# Altium project StrainLogger.PrjPCB
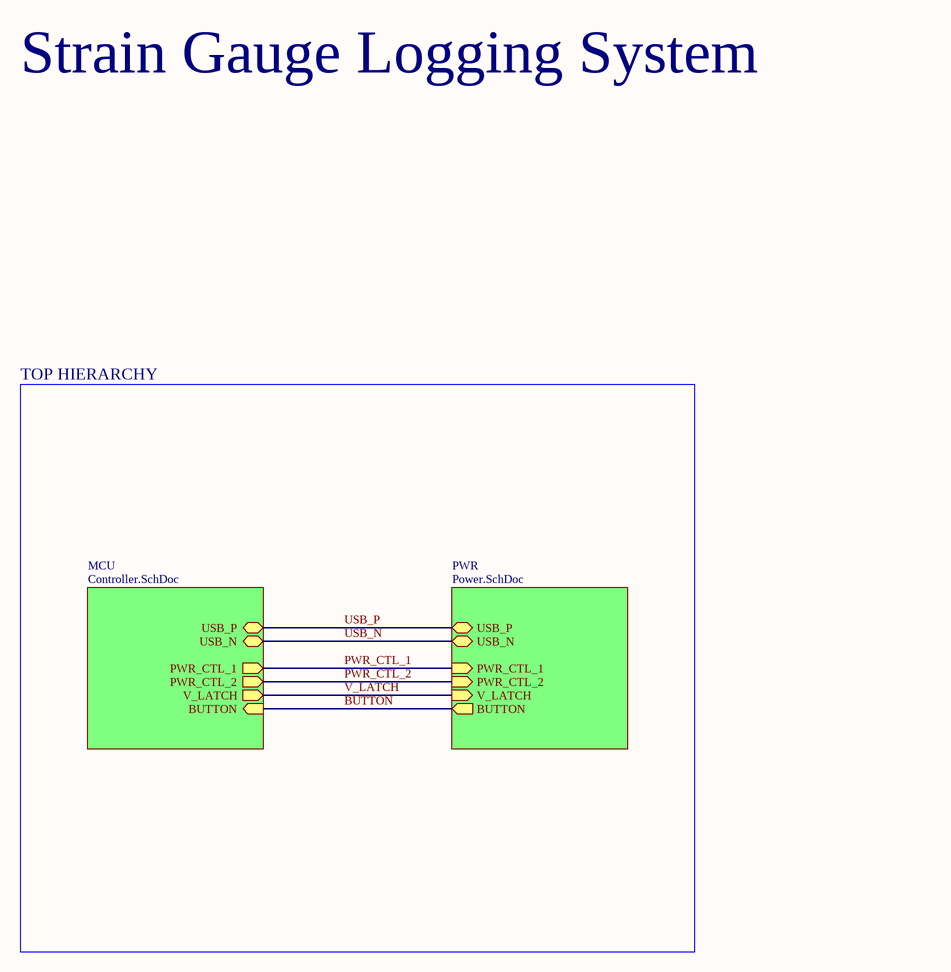
[diagram p0: TopSheet.SchDoc]
SheetTotal: 4; ProjectRevision: 1.0; ProjectAuthor: Jamie Stepanian; Project: Strain Logger
4 sheets, 171 parts. Net scope: hierarchical (ports join the sheet entries above them; power ports are global).
Board file: StrainLogger.PcbDoc
Sheets:
  TopSheet.SchDoc
    MCU = Controller.SchDoc
      ST1 = Strain-TI.SchDoc
      ST2 = Strain-TI.SchDoc
      ST3 = Strain-TI.SchDoc
      ST4 = Strain-TI.SchDoc
    PWR = Power.SchDoc

## Sheet TopSheet.SchDoc
size 431 x 279 mm; SheetNumber: 1; SheetTotal: 4; SheetTitle: Top

### Sub-sheets
MCU = Controller.SchDoc: USB_N (bidir), USB_P (bidir), PWR_CTL_2 (out), PWR_CTL_1 (out), V_LATCH (out), BUTTON (in)
PWR = Power.SchDoc: USB_P (bidir), BUTTON (out), USB_N (bidir), PWR_CTL_1 (in), PWR_CTL_2 (in), V_LATCH (in)

### Nets
BUTTON: sheet MCU/BUTTON, sheet PWR/BUTTON
PWR_CTL_1: sheet MCU/PWR_CTL_1, sheet PWR/PWR_CTL_1
PWR_CTL_2: sheet MCU/PWR_CTL_2, sheet PWR/PWR_CTL_2
USB_N: sheet MCU/USB_N, sheet PWR/USB_N
USB_P: sheet MCU/USB_P, sheet PWR/USB_P
V_LATCH: sheet MCU/V_LATCH, sheet PWR/V_LATCH

### Notes on the sheet
- Strain Gauge Logging System
- TOP HIERARCHY
- Variant name
- Number:
- Date:
- Revision:
- Sheet
- of
- Drawn by
- Verified by:

## Sheet Controller.SchDoc
size 431 x 279 mm; SheetNumber: 2; SheetTotal: 4; SheetTitle: Controller
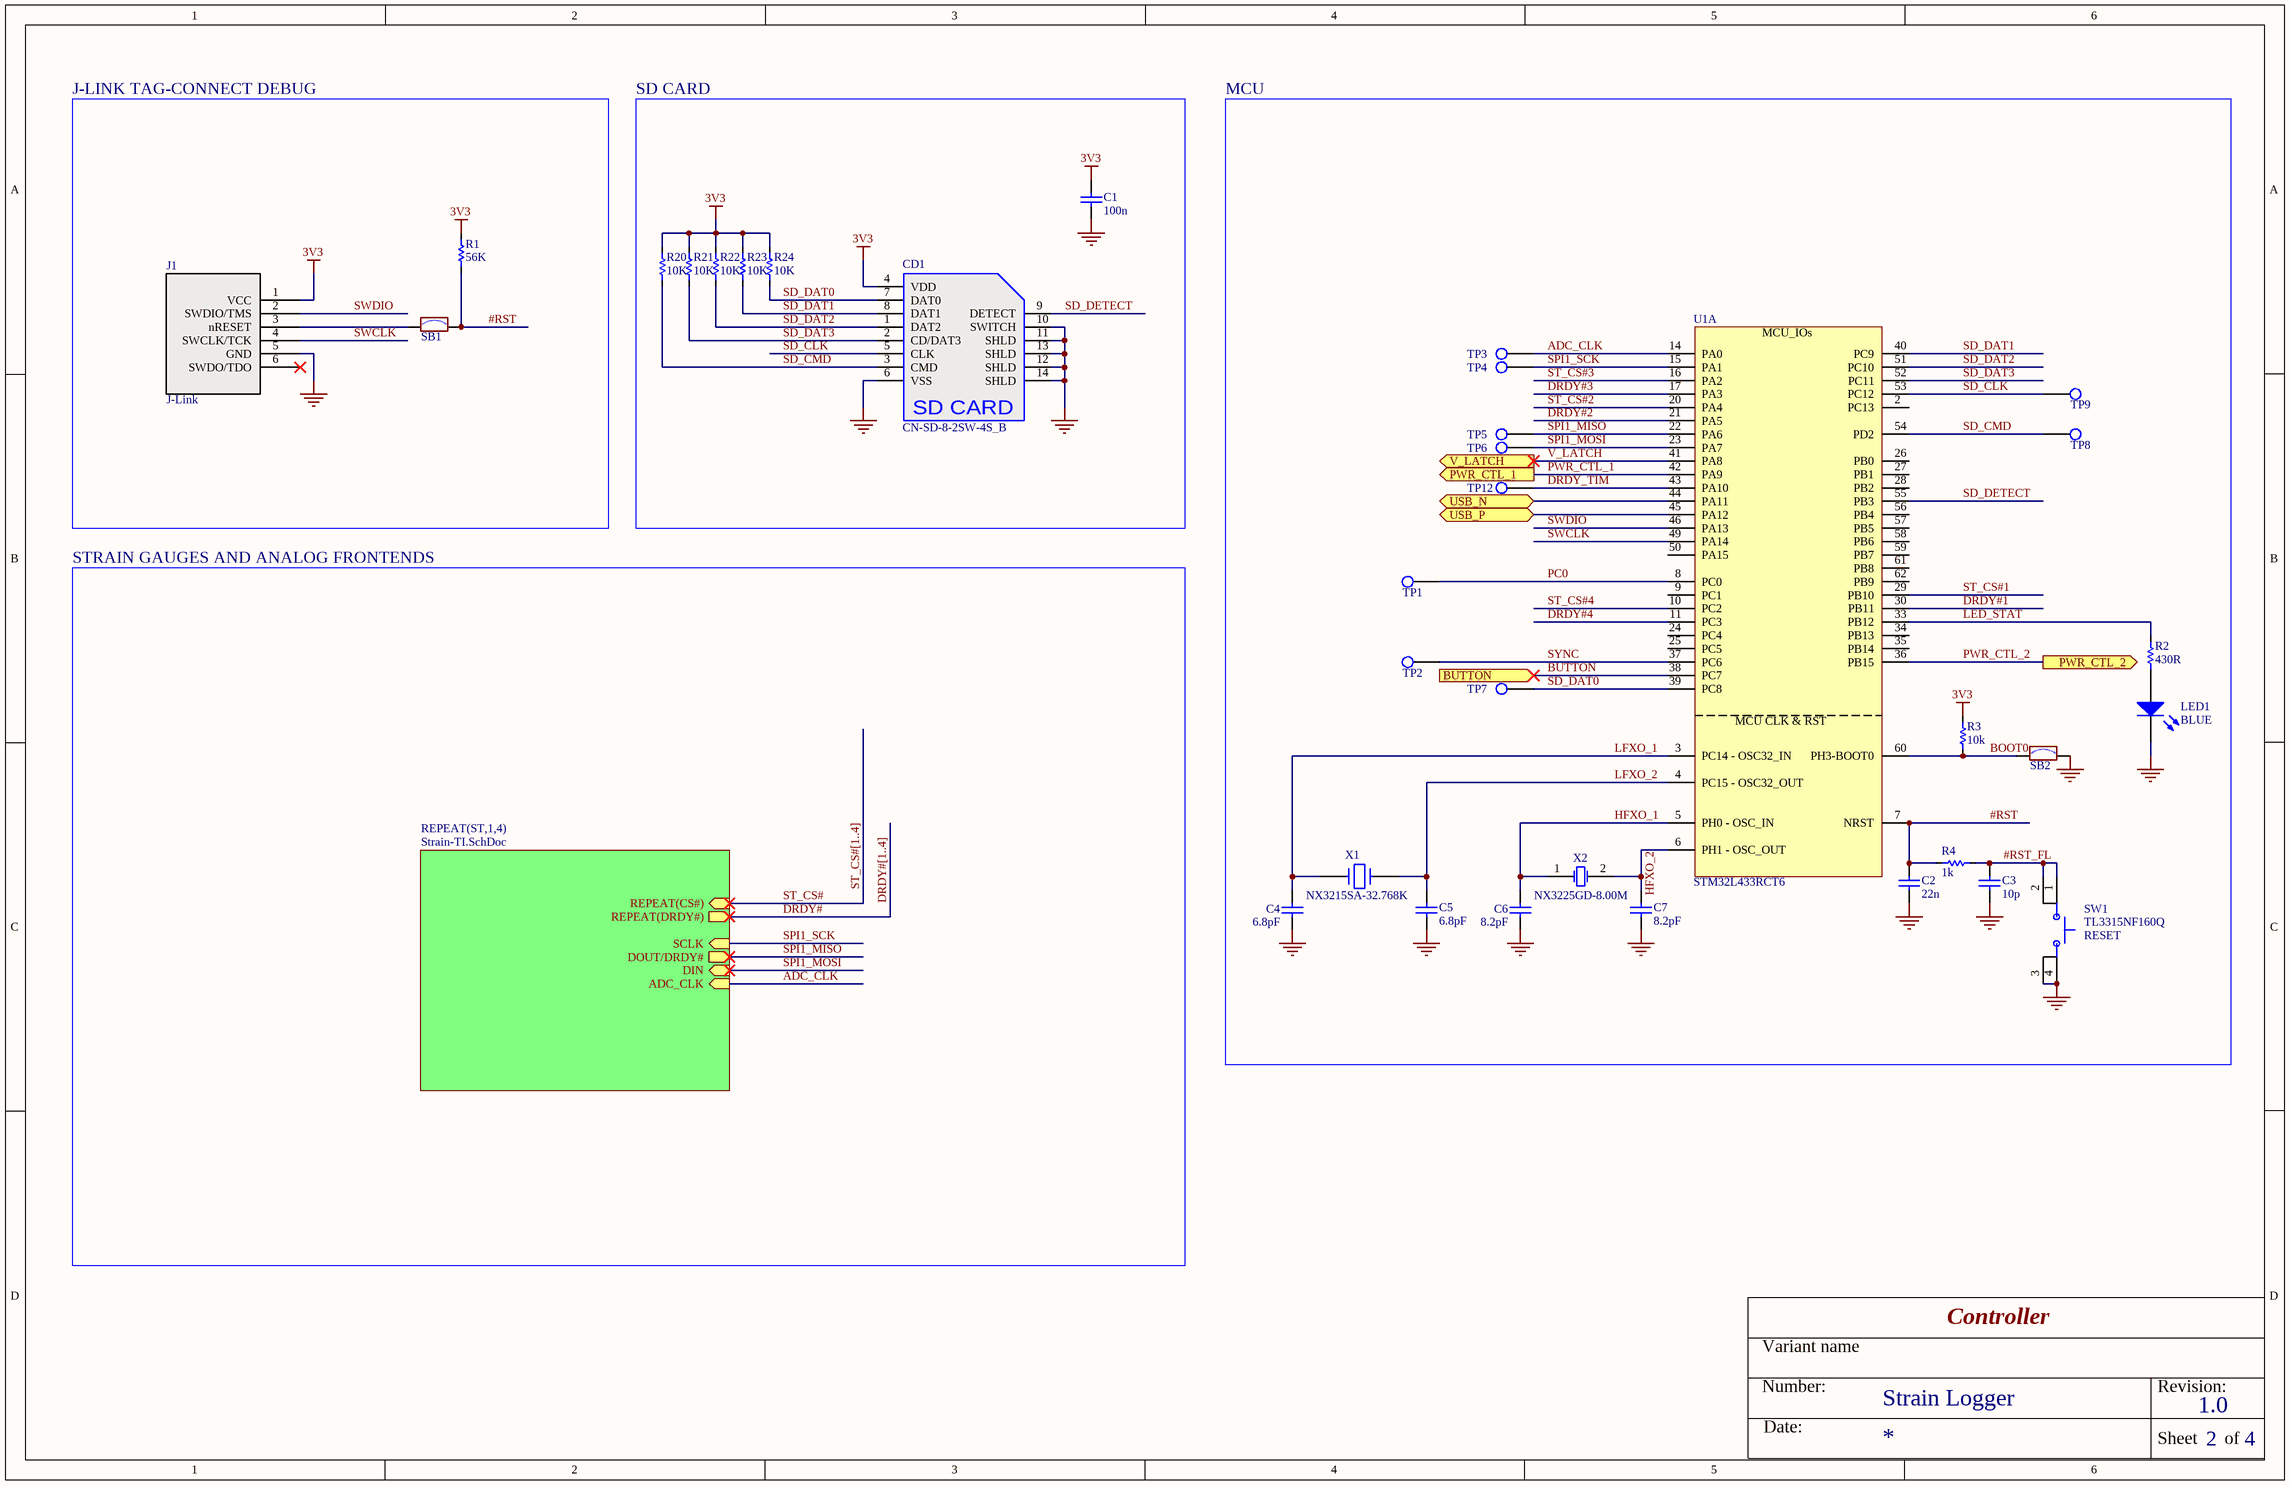
[diagram p1: Controller.SchDoc]

### Parts
C1  100n  [CAP_0603_M]
C2  22n  [CAP_0603_M]
C3  10p  [CAP_0603_M]
C4  value 6.8pF  [CAP_0402_M]  (hidden comment: Capacitor)
C5  value 6.8pF  [CAP_0402_M]  (hidden comment: Capacitor)
C6  value 8.2pF  [CAP_0402_M]  (hidden comment: Capacitor)
C7  value 8.2pF  [CAP_0402_M]  (hidden comment: Capacitor)
CD1  CN-SD-8-2SW-4S_B  [MOLX-502774-0891_V]
J1  J-Link  [TC2030-MCP-NL_R2]  (no BOM)
LED1  BLUE  [0603_A]
R1  56K  [RES_0603_M]
R2  430R  [RES_0603_M]
R3  10k  [RES_0603_M]
R4  1k  [RES_0603_M]
R20  10K  [RES_0402]
R21  10K  [RES_0402]
R22  10K  [RES_0402]
R23  10K  [RES_0402]
R24  10K  [RES_0402]
SB1  SB_ON  [SOLDER-BRIDGE_R0603-0R]  (value not drawn)  (no BOM)
SB2  SB_ON  [SOLDER-BRIDGE_R0603-0R]  (value not drawn)  (no BOM)
SW1  TL3315NF160Q  [E-Switch_TL3315NF160Q]
TP1  TP-1.5mm  [TP-1.5mm]  (value not drawn)
TP2  TP-1.5mm  [TP-1.5mm]  (value not drawn)
TP3  TP-1.5mm  [TP-1.5mm]  (value not drawn)
TP4  TP-1.5mm  [TP-1.5mm]  (value not drawn)
TP5  TP-1.5mm  [TP-1.5mm]  (value not drawn)
TP6  TP-1.5mm  [TP-1.5mm]  (value not drawn)
TP7  TP-1.5mm  [TP-1.5mm]  (value not drawn)
TP8  TP-1.5mm  [TP-1.5mm]  (value not drawn)
TP9  TP-1.5mm  [TP-1.5mm]  (value not drawn)
TP12  TP-1.5mm  [TP-1.5mm]  (value not drawn)
U1  STM32L433RCT6  [ICC_LQFP64_10X10_P050]  (part A of 2)
X1  value NX3215SA-32.768K  [CRY_NX3215SA_2P]  (hidden comment: XTAL_32K_NX3215SA)
X2  value NX3225GD-8.00M  [CRY_NX3225GD_2P]  (hidden comment: XTAL_8M_NX3225GD)

### Blocks framed on the sheet
J-LINK TAG-CONNECT DEBUG: J1 R1 SB1
SD CARD: C1 CD1 R20-R24
MCU: C2-C7 LED1 R2-R4 SB2 SW1 TP1-TP9 TP12 U1 X1 X2

### Sub-sheets
REPEAT(ST,1,4) = Strain-TI.SchDoc: REPEAT(CS#) (in), SCLK (in), DIN (in), DOUT/DRDY# (out), REPEAT(DRDY#) (out), ADC_CLK (in)

### Ports
BUTTON (in), PWR_CTL_1 (out), PWR_CTL_2 (out), USB_N (bidir), USB_P (bidir), V_LATCH (out)

### Nets
3V3: C1.2 CD1.4(VDD) J1.1(VCC) R1.2 R3.2 R20.2 R21.2 R22.2 R23.2 R24.2  [project net BR_VDD]
GND: C1.1 C2.1 C3.1 C4.2 C5.2 C6.1 C7.1 CD1.6(VSS) CD1.10(SWITCH) CD1.11(SHLD) CD1.12(SHLD) CD1.13(SHLD) CD1.14(SHLD) J1.5(GND) LED1.1(K) SB2.2 SW1.3 SW1.4
#RST: C2.2 R1.1 R4.2 SB1.2 U1.7(NRST)  [project net #RST_2]
#RST_FL: C3.2 R4.1 SW1.1 SW1.2  [project net #RST_FL_2]
ADC_CLK: TP3.1 U1.14(PA0) ; sheet REPEAT(ST,1,4)/ADC_CLK
BOOT0: R3.1 SB2.1 U1.60(PH3-BOOT0)  [project net BOOT0_2]
BUTTON: U1.38(PC7) ; port BUTTON
DRDY#: sheet REPEAT(ST,1,4)/REPEAT(DRDY#)
DRDY#1: U1.30(PB11)
DRDY#2: U1.21(PA5)
DRDY#3: U1.17(PA3)
DRDY#4: U1.11(PC3)
DRDY_TIM: TP12.1 U1.43(PA10)  [project net DRDY_TIM_2]
HFXO_1: C6.2 U1.5(PH0_-_OSC_IN) X2.1(OSC1)  [project net HFXO_1_2]
HFXO_2: C7.2 U1.6(PH1_-_OSC_OUT) X2.2(OSC2)  [project net HFXO_2_2]
LED_STAT: R2.2 U1.33(PB12)  [project net LED_STAT_2]
LFXO_1: C4.1 U1.3(PC14_-_OSC32_IN) X1.1  [project net LFXO_1_2]
LFXO_2: C5.1 U1.4(PC15_-_OSC32_OUT) X1.2  [project net LFXO_2_2]
PC0: TP1.1 U1.8(PC0)  [project net PC0_2]
PWR_CTL_1: U1.42(PA9) ; port PWR_CTL_1
PWR_CTL_2: U1.36(PB15) ; port PWR_CTL_2
SD_CLK: CD1.5(CLK) TP9.1 U1.53(PC12)  [project net SD_CLK_2]
SD_CMD: CD1.3(CMD) R20.1 TP8.1 U1.54(PD2)  [project net SD_CMD_2]
SD_DAT0: CD1.7(DAT0) R24.1 TP7.1 U1.39(PC8)  [project net SD_DAT0_2]
SD_DAT1: CD1.8(DAT1) R23.1 U1.40(PC9)  [project net SD_DAT1_2]
SD_DAT2: CD1.1(DAT2) R22.1 U1.51(PC10)  [project net SD_DAT2_2]
SD_DAT3: CD1.2(CD/DAT3) R21.1 U1.52(PC11)  [project net SD_DAT3_2]
SD_DETECT: CD1.9(DETECT) U1.55(PB3)  [project net SD_DETECT_2]
SPI1_MISO: TP5.1 U1.22(PA6) ; sheet REPEAT(ST,1,4)/DOUT/DRDY#
SPI1_MOSI: TP6.1 U1.23(PA7) ; sheet REPEAT(ST,1,4)/DIN
SPI1_SCK: TP4.1 U1.15(PA1) ; sheet REPEAT(ST,1,4)/SCLK
ST_CS#: sheet REPEAT(ST,1,4)/REPEAT(CS#)
ST_CS#1: U1.29(PB10)
ST_CS#2: U1.20(PA4)
ST_CS#3: U1.16(PA2)
ST_CS#4: U1.10(PC2)
SWCLK: J1.4(SWCLK/TCK) U1.49(PA14)  [project net SWCLK_2]
SWDIO: J1.2(SWDIO/TMS) U1.46(PA13)  [project net SWDIO_2]
SYNC: TP2.1 U1.37(PC6)  [project net SYNC_2]
USB_N: U1.44(PA11) ; port USB_N
USB_P: U1.45(PA12) ; port USB_P
V_LATCH: U1.41(PA8) ; port V_LATCH
NetJ1_3: J1.3(nRESET) SB1.1
NetLED1_2: LED1.2(A) R2.1

Not connected (* = marked no-connect by the designer): J1 6(SWDO/TDO)*; U1 2(PC13) 9(PC1) 24(PC4) 25(PC5) 26(PB0) 27(PB1) 28(PB2) 34(PB13) 35(PB14) 50(PA15) 56(PB4) 57(PB5) 58(PB6) 59(PB7) 61(PB8) 62(PB9)

### Buses and harness runs
bus DRDY#[1..4]
bus ST_CS#[1..4]

### Notes on the sheet
- STRAIN GAUGES AND ANALOG FRONTENDS
- (near SW1) RESET
- Variant name
- Number:
- Date:
- Revision:
- Sheet
- of
- (in symbol MOLEX_CN-SD-8-2SW-4S_B) SD CARD
- (in symbol STM32L433RCT6, part A) MCU_IOs; MCU CLK & RST

### Library data of the parts
C1 = CAP_0603: CAP 100nF 6.3V 20% X7R 0603; Category: capacitor; Created: 2018-07-01; Created By: JS; Last Modified: 2018-07-01
C2 = CAP_0603: CAP 22nF 6.3V 20% X7R 0603; Category: capacitor; Created: 2018-07-01; Created By: JS; Last Modified: 2018-07-01
C3 = CAP_0603: CAP 10pF 6.3V 20% NP0 0603; Category: capacitor; Created: 2018-07-01; Created By: JS; Last Modified: 2018-07-01
C4 C5 = MCD-00674: CAP 6.8pF 25V 4% NP0 0402; Manufacturer_Part_Number: CC0402CRNPO9BN6R8; Manufacturer: YAGEO; Provided_By: Subcon; Initial_Board_Reference: mb1319; Internal_Part_Number: MCD-00674; Status: Released; Part_Type: Capacitor; Package: C0402; ComponentLink1Description: Yageo_Capacitor_NP0_16V-to-50V.pdf; ComponentLink1URL: http://tunmcdsvn.tun.st.com/Component_Datasheet_Library/Trunk/Capacitors/Yageo_Capacitor_NP0_16V-to-50V.pdf; ECCN_US: n/a; ECCN_EU: n/a
C6 C7 = MCD-00004: CAP 8.2pF 25V 4% NP0 0402; Manufacturer_Part_Number: 04025A8R2CAT2A; Manufacturer: AVX; Provided_By: Subcon; Initial_Board_Reference: mb1274; Internal_Part_Number: MCD-00004; ComponentLink1Description: AVX_Capacitor_C0G-NP0-series.pdf; ECCN_US: n/a; ECCN_EU: n/a; Status: Released; Part_Type: Capacitor; Package: 0402
CD1 = MOLEX_CN-SD-8-2SW-4S_B: Micro SD Card Slot; Manufacturer PN: 502774-0891_V; Manufacturer: Molex
J1 = TC2030-CTX-NL
LED1 = CMP-1426-00005-1: SMD LED Blue 0603; PartNumber: 150060YS75000; Manufacturer: Wuerth Elektronik; Color: Yellow; ComponentLink1URL: http://www.we-online.com; ComponentLink2Description: Datasheet; ComponentLink2URL: http://katalog.we-online.com/led/datasheet/150060YS75000.pdf; ComponentLink1Description: Manufacturer URL; PackageReference: 0603_A
R1 = RES_0603: RES 56K 1/5W 0603; Manufacturer: *; Manufacturer PN: *; Category: resistor; Created: 2018-07-01; Last Modified: 2018-07-01; Created By: JS
R2 = RES_0603: RES 430R 1/5W 0603; Manufacturer: *; Manufacturer PN: *; Category: resistor; Created: 2018-07-01; Last Modified: 2018-07-01; Created By: JS
R3 = RES_0603: RES 10K 1/5W 0603; Manufacturer: *; Manufacturer PN: *; Category: resistor; Created: 2018-07-01; Last Modified: 2018-07-01; Created By: JS
R4 = RES_0603: RES 1K 1/5W 0603; Manufacturer: *; Manufacturer PN: *; Category: resistor; Created: 2018-07-01; Last Modified: 2018-07-01; Created By: JS
R20-R24 = RES_0402: RES 10K 1/5W 0402; Manufacturer: *; Manufacturer PN: *; Category: resistor; Created: 2018-09-12; Last Modified: 2018-09-12; Created By: JS
SB1 SB2 = SB_ON: Solder Bridge ON; Internal_Part_Number: MCD-00071; Part_Type: Mechanical; Provided_By: Subcon; Initial_Board_Reference: mb1274; ECCN_US: n/a; ECCN_EU: n/a; Status: Released
SW1 = E-SWITCH_TL3315NF160Q: SWITCH TACTILE SPST-NO 0.05A 15V
TP1 = TP-1.5mm: Test Point; PCB_Label: PC0
TP2 = TP-1.5mm: Test Point; PCB_Label: SYNC
TP3-TP9 TP12 = TP-1.5mm: Test Point; PCB_Label: ADC_CLK
U1 = STM32L433RCT6: Microcontroller 256_STM32L433 . LQFP64 package; Internal_Part_Number: MCD-00548; Part_Type: IC; Manufacturer: STMICROELECTRONICS; ECCN_US: 3A991A2; ECCN_EU: NEC; Provided_By: STM; Initial_Board_Reference: mb1319; Status: Symbol available; Manufacturer_Part_Number: STM32L433RCT6; Value: STM32L433RCT6
X1 = XTAL_32K_NX3215SA: Crystal 32.768kHz, 6pF, -+20PPM, R=50K, SMD; Internal_Part_Number: MCD-00091; Manufacturer_Part_Number: NX3215SA 32.768KHz EXS00A-MU00525; Manufacturer: NDK; Part_Type: Crystal_Osc; ECCN_US: EAR99; ECCN_EU: NEC; Provided_By: STM; Initial_Board_Reference: mb1274; ComponentLink1Description: NDK_Crystal-For-ST_NX3215SA 32.768KHz EXS00A-MU00525 (EXS10B-21238).pdf; Status: Released
X2 = XTAL_8M_NX3225GD: Crystal 8Mhz, 8pF, -+50PPM, SMD; Internal_Part_Number: MCD-00092; Manufacturer_Part_Number: NX3225GD 8MHz EXS00A-CG04874; Manufacturer: NDK; Part_Type: Crystal_Osc; ECCN_US: EAR99; ECCN_EU: NEC; Provided_By: STM; Initial_Board_Reference: mb1274; ComponentLink1Description: NDK_Crystal-For-ST_NX3225GD 8MHz EXS00A-CG04874 (EXS10B-20725).pdf; Status: Released

## Sheet Strain-TI.SchDoc
size 297 x 209 mm; SheetNumber: 4; SheetTotal: 4; SheetTitle: Strain Gauge Frontend
Used 4 times, as channels MCU/ST1, MCU/ST2, MCU/ST3, MCU/ST4. Parts and nets are listed once, with the designators drawn on the sheet.
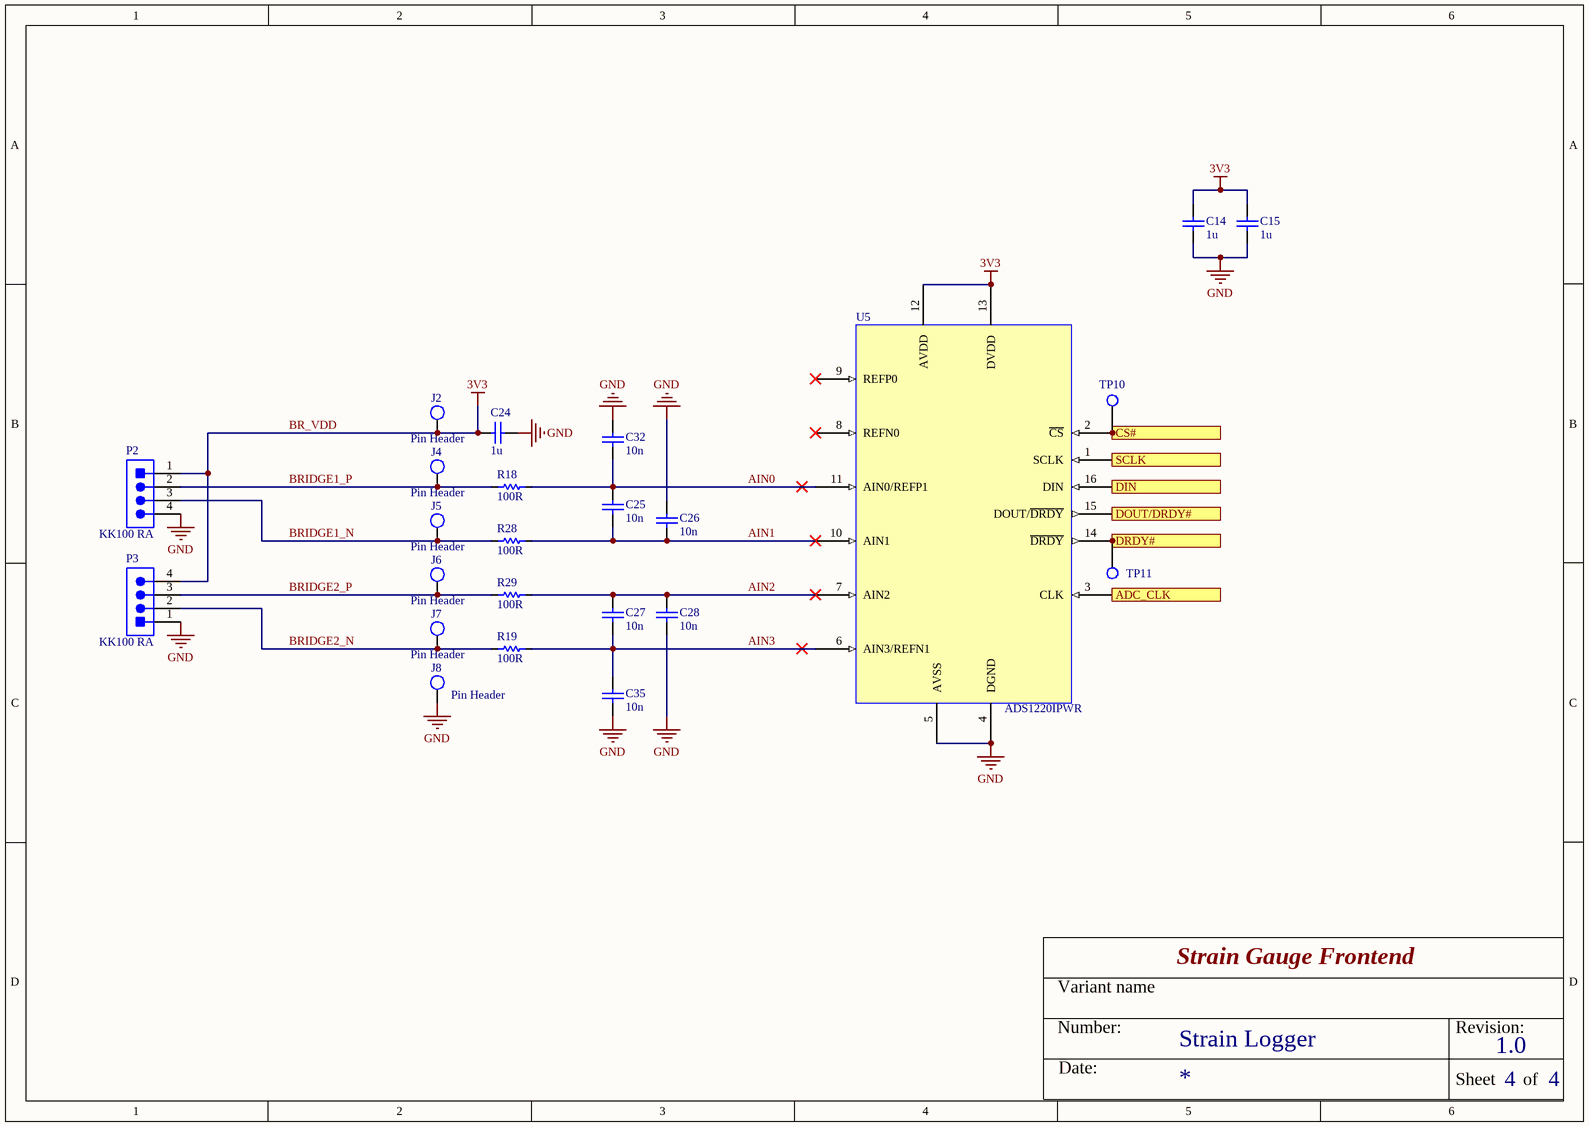
[diagram p2: Strain-TI.SchDoc]

### Parts
C14  1u  [CAP_0603_M]
C15  1u  [CAP_0603_M]
C24  1u  [CAP_0603_M]
C25  10n  [CAP_0603_M]
C26  10n  [CAP_0603_M]
C27  10n  [CAP_0603_M]
C28  10n  [CAP_0603_M]
C32  10n  [CAP_0603_M]
C35  10n  [CAP_0603_M]
J2  Pin Header  [PIN_HEADER_1POS]
J4  Pin Header  [PIN_HEADER_1POS]
J5  Pin Header  [PIN_HEADER_1POS]
J6  Pin Header  [PIN_HEADER_1POS]
J7  Pin Header  [PIN_HEADER_1POS]
J8  Pin Header  [PIN_HEADER_1POS]
P2  KK100 RA  [MOLEX_KK100_RA_4P]
P3  KK100 RA  [MOLEX_KK100_RA_4P]
R18  100R  [RES_0603_M]
R19  100R  [RES_0603_M]
R28  100R  [RES_0603_M]
R29  100R  [RES_0603_M]
TP10  TP-1.5mm  [TP-1.5mm]  (value not drawn)
TP11  TP-1.5mm  [TP-1.5mm]  (value not drawn)
U5  ADS1220IPWR  [TI_PW_SOP127P600-8N]

### Ports
ADC_CLK (in), CS# (in), DIN (in), DOUT/DRDY# (out), DRDY# (out), SCLK (in)

### Nets
BR_VDD: C14.2 C15.2 C24.1 J2.1 P2.1 P3.4 U5.12(AVDD) U5.13(DVDD)  [also labelled 3V3]
GND: C14.1 C15.1 C24.2 C26.2 C28.2 C32.2 C35.1 J8.1 P2.4 P3.1 U5.4(DGND) U5.5(AVSS)
ADC_CLK: U5.3(CLK) ; port ADC_CLK
AIN0: C25.2 C32.1 R18.2 U5.11(AIN0/REFP1)  [project net AIN0_4]
AIN1: C25.1 C26.1 R28.2 U5.10(AIN1)  [project net AIN1_4]
AIN2: C27.2 C28.1 R29.2 U5.7(AIN2)  [project net AIN2_4]
AIN3: C27.1 C35.2 R19.2 U5.6(AIN3/REFN1)  [project net AIN3_4]
BRIDGE1_N: J5.1 P2.3 R28.1  [project net BRIDGE1_N_4]
BRIDGE1_P: J4.1 P2.2 R18.1  [project net BRIDGE1_P_4]
BRIDGE2_N: J7.1 P3.2 R19.1  [project net BRIDGE2_N_4]
BRIDGE2_P: J6.1 P3.3 R29.1  [project net BRIDGE2_P_4]
CS#: TP10.1 U5.2(~{CS}) ; port CS#
DIN: U5.16(DIN) ; port DIN
DOUT/DRDY#: U5.15(DOUT/~{DRDY}) ; port DOUT/DRDY#
DRDY#: TP11.1 U5.14(~{DRDY}) ; port DRDY#
SCLK: U5.1(SCLK) ; port SCLK

Not connected (* = marked no-connect by the designer): U5 8(REFN0)* 9(REFP0)*

### Channels
MCU/ST1: designators end in _ST1; ports ADC_CLK=ADC_CLK CS#=ST_CS#1 DIN=SPI1_MOSI DOUT/DRDY#=SPI1_MISO DRDY#=DRDY#1 SCLK=SPI1_SCK
MCU/ST2: designators end in _ST2; ports ADC_CLK=ADC_CLK CS#=ST_CS#2 DIN=SPI1_MOSI DOUT/DRDY#=SPI1_MISO DRDY#=DRDY#2 SCLK=SPI1_SCK
MCU/ST3: designators end in _ST3; ports ADC_CLK=ADC_CLK CS#=ST_CS#3 DIN=SPI1_MOSI DOUT/DRDY#=SPI1_MISO DRDY#=DRDY#3 SCLK=SPI1_SCK
MCU/ST4: designators end in _ST4; ports ADC_CLK=ADC_CLK CS#=ST_CS#4 DIN=SPI1_MOSI DOUT/DRDY#=SPI1_MISO DRDY#=DRDY#4 SCLK=SPI1_SCK

### Notes on the sheet
- Variant name
- Number:
- Date:
- Revision:
- Sheet
- of

### Library data of the parts
C14 C15 C24 = CAP_0603: CAP 1uF 6.3V 20% X7R 0603; Category: capacitor; Created: 2018-07-01; Created By: JS; Last Modified: 2018-07-01
C25-C28 C32 C35 = CAP_0603: CAP 10nF 6.3V 20% X7R 0603; Category: capacitor; Created: 2018-07-01; Created By: JS; Last Modified: 2018-07-01
J2 J4-J8 = PIN_HEADER_1POS: Pin Header 0.1" 1pos
P2 P3 = MOLEX_KK100_RA_4P: Right angle rectangular connector, KK100, 4pos; Manufacturer: Molex; Manufacturer PN: 0022053041
R18 R19 R28 R29 = RES_0603: RES 100R 1/5W 0603; Manufacturer: *; Manufacturer PN: *; Category: resistor; Created: 2018-07-01; Last Modified: 2018-07-01; Created By: JS
TP10 TP11 = TP-1.5mm: Test Point; PCB_Label: ADC_CLK
U5 = TI_ADS1220IPWR: ADS1220 4-Channel, 2-kSPS, Low-Power, 24-Bit ADC with Integrated PGA and Reference; Manufacturer: TI; Manufacturer PN: ADS1220IPWR

## Sheet Power.SchDoc
size 431 x 279 mm; SheetNumber: 3; SheetTotal: 4; SheetTitle: Power
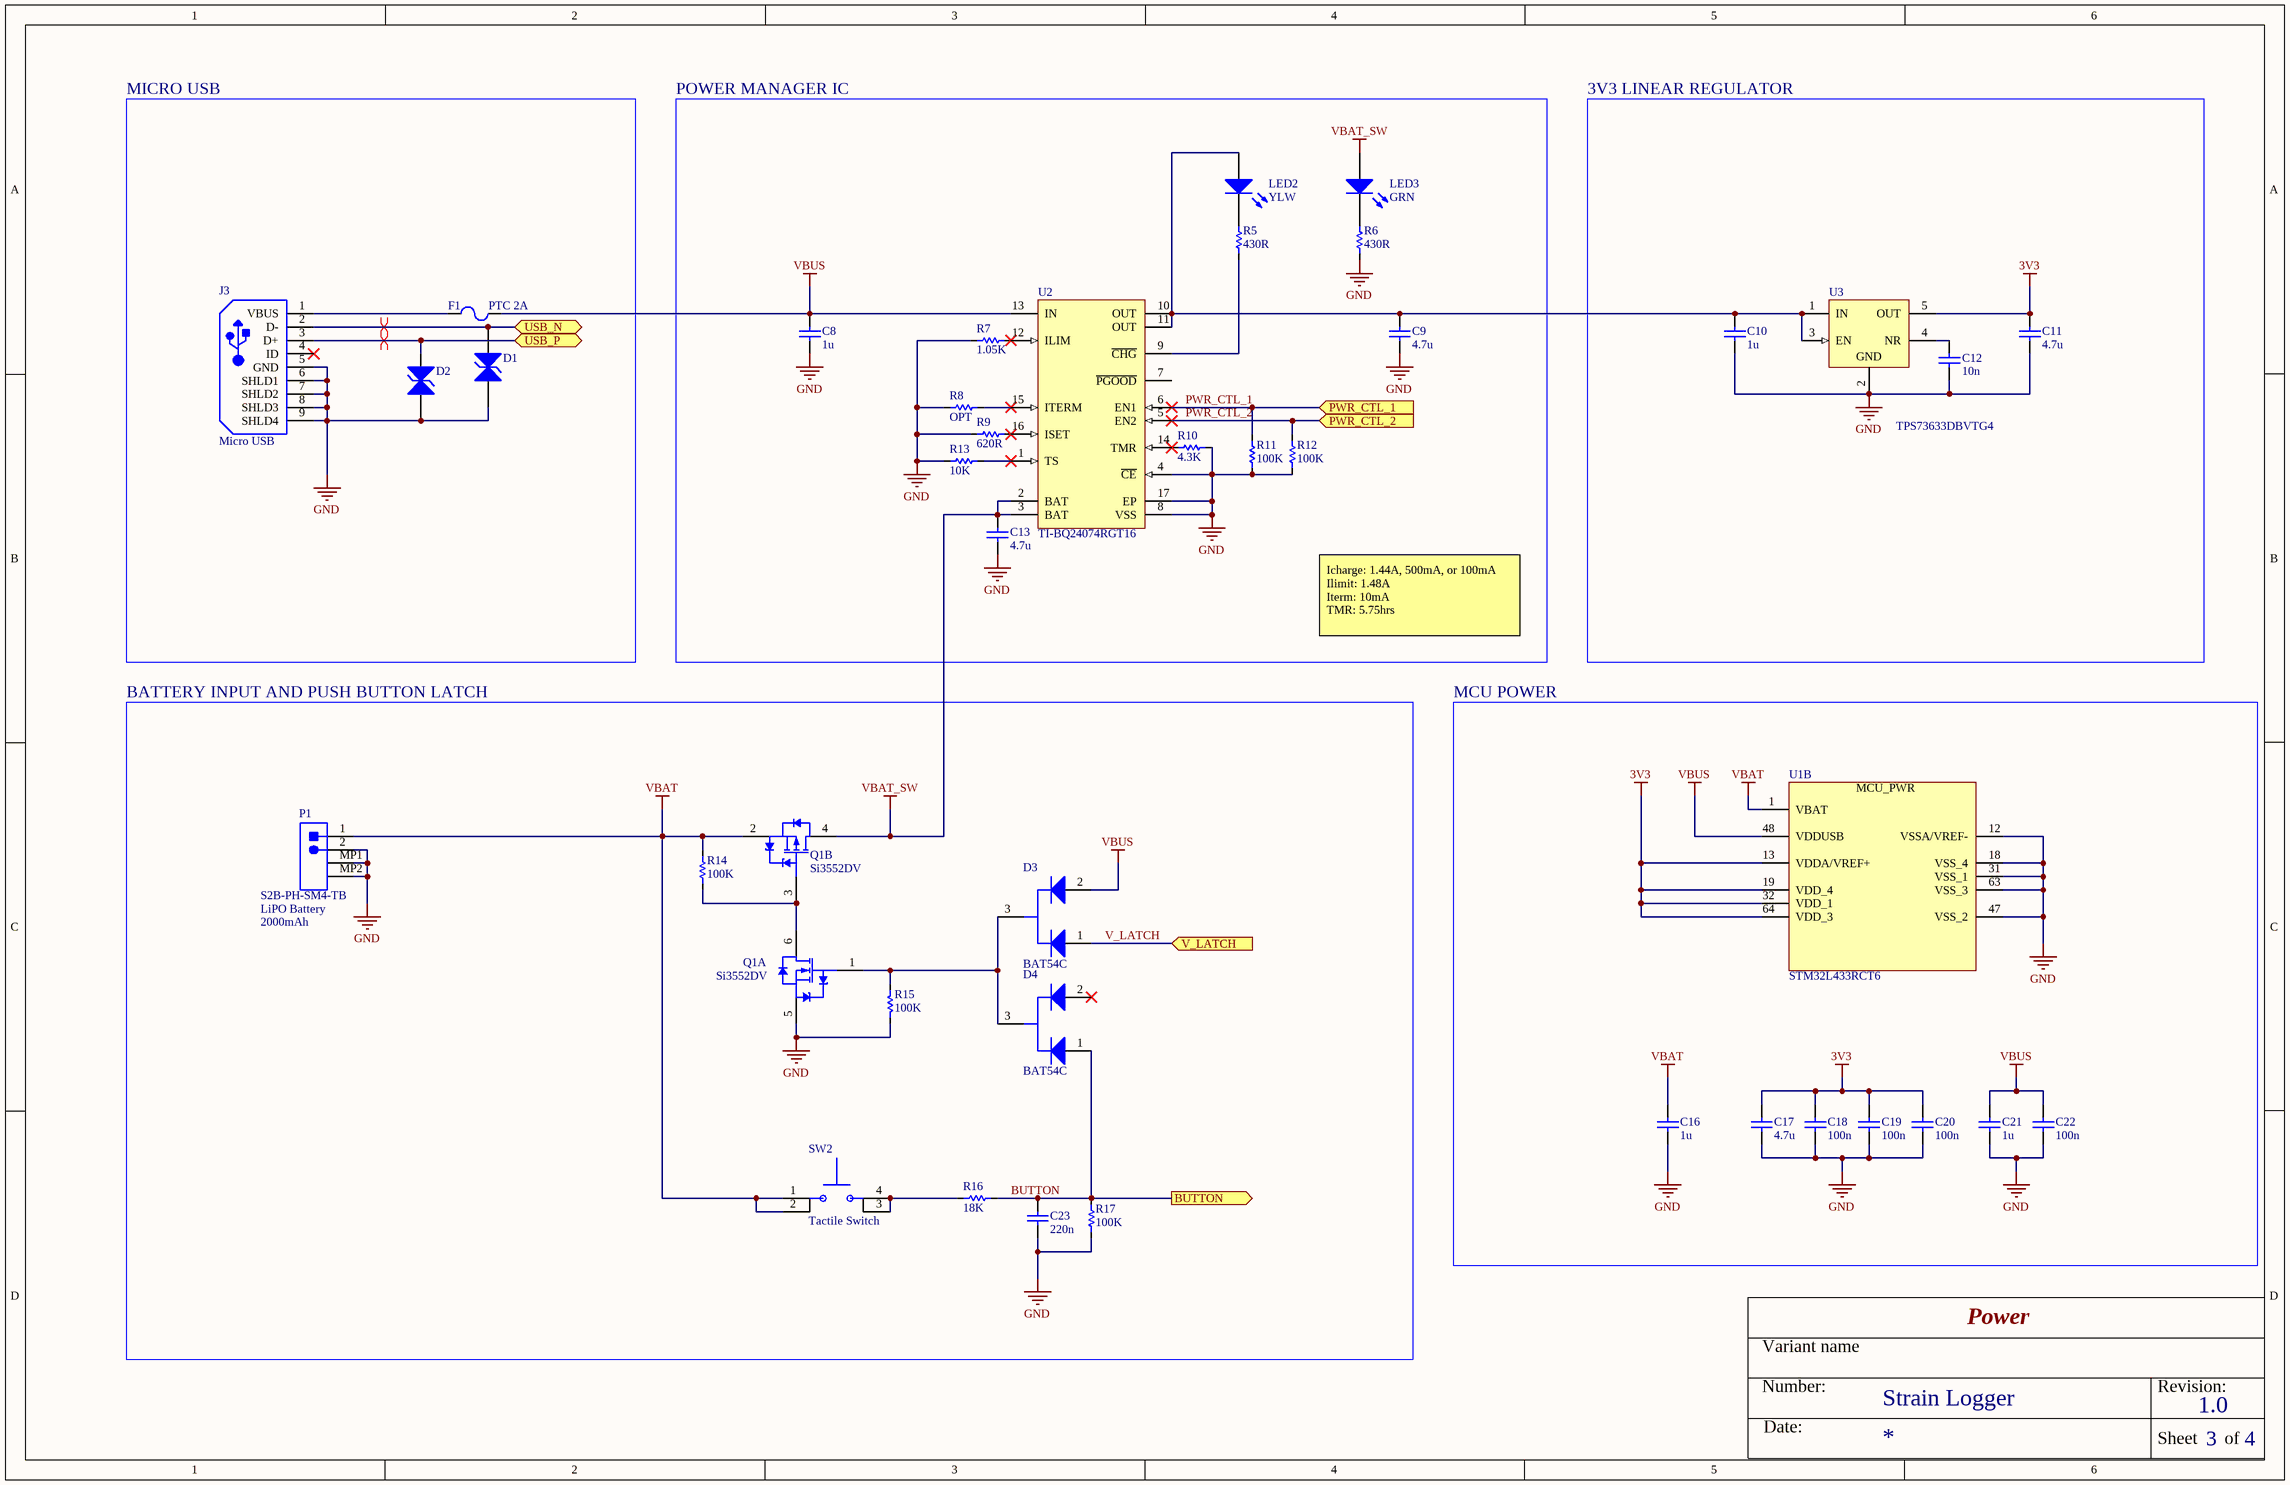
[diagram p3: Power.SchDoc]

### Parts
C8  1u  [CAP_0603_M]
C9  4.7u  [CAP_0603_M]
C10  1u  [CAP_0603_M]
C11  4.7u  [CAP_0603_M]
C12  10n  [CAP_0603_M]
C13  4.7u  [CAP_0603_M]
C16  1u  [CAP_0603_M]
C17  4.7u  [CAP_0603_M]
C18  100n  [CAP_0603_M]
C19  100n  [CAP_0603_M]
C20  100n  [CAP_0603_M]
C21  1u  [CAP_0603_M]
C22  100n  [CAP_0603_M]
C23  220n  [CAP_0603_M]
D1  PGB1010402KR  [LFUS-PGB1010402KR-2_V]  (value not drawn)
D2  PGB1010402KR  [LFUS-PGB1010402KR-2_V]  (value not drawn)
D3  BAT54C  [ONSC-BAT54CL_SOT-23]
D4  BAT54C  [ONSC-BAT54CL_SOT-23]
F1  PTC 2A  [PTC_1206_M]
J3  Micro USB  [HIRO-ZX62D-B-5P8_V]
LED2  YLW  [0603_A]
LED3  GRN  [0603_A]
P1  S2B-PH-SM4-TB  [JST- S2B-PH-SM4-TB(LF)(SN)-2_V]
Q1  Si3552DV  [VISHAY-TSOP6]  (parts A,B of 2)
R5  430R  [RES_0603_M]
R6  430R  [RES_0603_M]
R7  1.05K  [RES_0603_M]
R8  OPT  [RES_0603_M]
R9  620R  [RES_0603_M]
R10  4.3K  [RES_0603_M]
R11  100K  [RES_0603_M]
R12  100K  [RES_0603_M]
R13  10K  [RES_0603_M]
R14  100K  [RES_0603_M]
R15  100K  [RES_0603_M]
R16  18K  [RES_0603_M]
R17  100K  [RES_0603_M]
SW2  Tactile Switch  [E-Switch_TL6120DF300QG]
U1  STM32L433RCT6  [ICC_LQFP64_10X10_P050]  (part B of 2)
U2  TI-BQ24074RGT16  [TI-BQ24074RGT16]
U3  TPS73633DBVTG4  [TI-DBV5_M]

### Blocks framed on the sheet
MICRO USB: D1 D2 F1 J3
POWER MANAGER IC: C8 C9 C13 LED2 LED3 R5-R13 U2
3V3 LINEAR REGULATOR: C10-C12 U3
BATTERY INPUT AND PUSH BUTTON LATCH: C23 D3 D4 P1 Q1 R14-R17 SW2
MCU POWER: C16-C22 U1

### Ports
BUTTON (out), PWR_CTL_1 (in), PWR_CTL_2 (in), USB_N (bidir), USB_P (bidir), V_LATCH (in)

### Nets
3V3: C11.2 C17.2 C18.2 C19.2 C20.2 U1.13(VDDA/VREF+) U1.19(VDD_4) U1.32(VDD_1) U1.64(VDD_3) U3.5(OUT)  [project net BR_VDD]
GND: C8.1 C9.1 C10.1 C11.1 C12.1 C13.1 C16.1 C17.1 C18.1 C19.1 C20.1 C21.1 C22.1 C23.1 D1.1(A1) D2.1(A1) J3.5(GND) J3.6(SHLD1) J3.7(SHLD2) J3.8(SHLD3) J3.9(SHLD4) P1.2 P1.MP1 P1.MP2 Q1.5(S1) R6.1 R7.1 R8.1 R9.1 R10.2 R11.1 R12.2 R13.1 R15.1 R17.1 U1.12(VSSA/VREF-) U1.18(VSS_4) U1.31(VSS_1) U1.47(VSS_2) U1.63(VSS_3) U2.4(~{CE}) U2.8(VSS) U2.17(EP) U3.2(GND)
VBAT: C16.2 P1.1 Q1.2(S2) R14.2 SW2.1 SW2.2 U1.1(VBAT)
VBAT_SW: C13.2 LED3.2(A) Q1.4(D2) U2.2(BAT) U2.3(BAT)
VBUS: C8.2 C21.2 C22.2 D3.2(A2) F1.2 U1.48(VDDUSB) U2.13(IN)
BUTTON: C23.2 D4.1(A1) R16.2 R17.2 ; port BUTTON
PWR_CTL_1: R11.2 U2.6(EN1) ; port PWR_CTL_1
PWR_CTL_2: R12.1 U2.5(EN2) ; port PWR_CTL_2
USB_N: D1.2(A2) J3.2(D-) ; port USB_N
USB_P: D2.2(A2) J3.3(D+) ; port USB_P
V_LATCH: D3.1(A1) ; port V_LATCH
NetC9_2: C9.2 C10.2 LED2.2(A) U2.10(OUT) U2.11(OUT) U3.1(IN) U3.3(EN)
NetC12_2: C12.2 U3.4(NR)
NetD3_3: D3.3(K) D4.3(K) Q1.1(G1) R15.2
NetF1_1: F1.1 J3.1(VBUS)
NetLED2_1: LED2.1(K) R5.2
NetLED3_1: LED3.1(K) R6.2
NetQ1_3: Q1.3(G2) Q1.6(D1) R14.1
NetR5_1: R5.1 U2.9(~{CHG})
NetR7_2: R7.2 U2.12(ILIM)
NetR8_2: R8.2 U2.15(ITERM)
NetR9_2: R9.2 U2.16(ISET)
NetR10_1: R10.1 U2.14(TMR)
NetR13_2: R13.2 U2.1(TS)
NetR16_1: R16.1 SW2.3 SW2.4

Not connected (* = marked no-connect by the designer): D4 2(A2)*; J3 4(ID)*; U2 7(~{PGOOD})

### Layout directives
differential pair: USB_N, USB_P

### Notes on the sheet
- Icharge: 1.44A, 500mA, or 100mA
  Ilimit: 1.48A
  Iterm: 10mA
  TMR: 5.75hrs
- (near P1) LiPO Battery
- (near P1) 2000mAh
- Variant name
- Number:
- Date:
- Revision:
- Sheet
- of
- (in symbol STM32L433RCT6, part B) MCU_PWR

### Library data of the parts
C8 = CAP_0603: CAP 1uF 10V 20% X7R 0603; Category: capacitor; Created: 2018-07-01; Created By: JS; Last Modified: 2018-07-01
C9 C11 C13 C17 = CAP_0603: CAP 4.7uF 6.3V 20% X7R 0603; Category: capacitor; Created: 2018-07-01; Created By: JS; Last Modified: 2018-07-01
C10 C16 C21 = CAP_0603: CAP 1uF 6.3V 20% X7R 0603; Category: capacitor; Created: 2018-07-01; Created By: JS; Last Modified: 2018-07-01
C12 = CAP_0603: CAP 10nF 6.3V 20% X7R 0603; Category: capacitor; Created: 2018-07-01; Created By: JS; Last Modified: 2018-07-01
C18-C20 C22 = CAP_0603: CAP 100nF 6.3V 20% X7R 0603; Category: capacitor; Created: 2018-07-01; Created By: JS; Last Modified: 2018-07-01
C23 = CAP_0603: CAP 220nF 6.3V 20% X7R 0603; Category: capacitor; Created: 2018-07-01; Created By: JS; Last Modified: 2018-07-01
D1 D2 = CMP-2000-05189-1: TVS, Polymeric ESD Suppressor, 12 V, -65 to 125 degC, 2-Pin SMD; Manufacturer: Littelfuse; Reverse Stand-off Voltage: 12V; Configuration: Single; Product Height (mm): 0.36mm; Product Length (mm): 1.66mm; Clamping Voltage (Max): 250V(Typ); Direction Type: Bi-Directional; Number of Elements: 1; Leakage Current: 0.001uA; Rad Hardened: No; Product Depth (mm): 0.84mm; Capacitance Value: 0.04pF; Operating Temp Range: -65Cto125C; Operating Temperature Max Deg. C: 125C; Datasheet Version: May-09; Manufacturer URL: http://www.littelfuse.com/; Packaging: TapeandReel; Package / Case: SMD; Working Voltage (Max): 12V; Operating Temperature Min Deg. C: -65C; Mounting Style: SurfaceMount; Datasheet URL: https://datasheet.ciiva.com/5837/575761-5837954.pdf; Operating Temperature Classification: Military; Pin Count: 2; Mounting: SurfaceMount; Leakage Current (Max): 0.001uA; Clamping Voltage: 250V(Typ); Suppressor Type: Polymer; Polarity: Bi-Directional; Working Voltage: 12V
D3 D4 = ONSC-D-A1A2K3-3
F1 = BEL_PTC_0ZCJ0200FF2C: PTC RESET FUSE 6V 2A 1206
J3 = HIRO-ZX62D-B-5P8_V: Micro-USB Connector, 9-Leads, Body 7.5x5.6mm, Pitch 0.65mm
LED2 = CMP-1426-00005-1: SMD mono-color Chip LED, WL-SMCW, Yellow; PartNumber: 150060YS75000; Manufacturer: Wuerth Elektronik; ComponentLink1URL: http://www.we-online.com; Color: Yellow; ComponentLink2Description: Datasheet; ComponentLink2URL: http://katalog.we-online.com/led/datasheet/150060YS75000.pdf; ComponentLink1Description: Manufacturer URL; PackageReference: 0603_A
LED3 = CMP-1426-00005-1: SMD LED Green 0603; PartNumber: 150060YS75000; Manufacturer: Wuerth Elektronik; Color: Yellow; ComponentLink1URL: http://www.we-online.com; ComponentLink2Description: Datasheet; ComponentLink2URL: http://katalog.we-online.com/led/datasheet/150060YS75000.pdf; ComponentLink1Description: Manufacturer URL; PackageReference: 0603_A
P1 = CMP-1755-00001-1: Male Header, Pitch 2 mm, 1 x 2 Position, Height 5.5 mm, -25 to 85 degC, RoHS, Tape and Reel; Current Rating: 3 A; ComponentLink1URL: http://www.jst.com/home2.html; Radiation Hardening: No; RoHSCompliant: True; Mount: Through Hole; Contact Material: Bronze; Package Quantity: 100; Width: 2.34 mm; DatasheetVersion: Dec-12; Height: 8.13 mm; Max Operating Temperature: 105degC; ComponentLink2Description: Datasheet; Lead Pitch: 0.1 inch; Contact Finish: Lead; Packaging: Bulk; Colour: Black; Contact Plating: Tin; Min Operating Temperature: -65degC; ComponentLink1Description: Manufacturer URL; PackageReference: S2B-PH-SM4-TB(LF)(SN)-2; PackageDescription: Male Header, Pitch 2 mm, 1 x 2 Position, Height 5.5 mm; ComponentLink2URL: http://www.jst-mfg.com/product/pdf/eng/ePH.pdf; Pins: 40; Length: 101.19 mm
Q1 = VISHAY_Si3552DV: N/P-Channel Mosfet 30V, 2.5A/-1.8A; Manufacturer: Vishay; Rds_N: 85mOhm; Rds_P: 165mOhm; Vgs(th): 1V; Manufacturer PN: Si3552DV; Vmax: 30V
R5 R6 = RES_0603: RES 430R 1/5W 0603; Manufacturer: *; Manufacturer PN: *; Category: resistor; Created: 2018-07-01; Last Modified: 2018-07-01; Created By: JS
R7 = RES_0603: RES 1.05K 1/5W 0603; Manufacturer: *; Manufacturer PN: *; Category: resistor; Created: 2018-07-01; Last Modified: 2018-07-01; Created By: JS
R8 = RES_0603: REMOVE; Manufacturer: *; Manufacturer PN: *; Category: resistor; Created: 2018-07-01; Last Modified: 2018-07-01; Created By: JS
R9 = RES_0603: RES 620R 1/5W 0603; Manufacturer: *; Manufacturer PN: *; Category: resistor; Created: 2018-07-01; Last Modified: 2018-07-01; Created By: JS
R10 = RES_0603: RES 4.3K 1/5W 0603; Manufacturer: *; Manufacturer PN: *; Category: resistor; Created: 2018-07-01; Last Modified: 2018-07-01; Created By: JS
R11 R12 R14 R15 R17 = RES_0603: RES 100K 1/5W 0603; Manufacturer: *; Manufacturer PN: *; Category: resistor; Created: 2018-07-01; Last Modified: 2018-07-01; Created By: JS
R13 = RES_0603: RES 10K 1/5W 0603; Manufacturer: *; Manufacturer PN: *; Category: resistor; Created: 2018-07-01; Last Modified: 2018-07-01; Created By: JS
R16 = RES_0603: RES 18K 1/5W 0603; Manufacturer: *; Manufacturer PN: *; Category: resistor; Created: 2018-07-01; Last Modified: 2018-07-01; Created By: JS
SW2 = E-Switch_TL6120DF300QG: SWITCH TACTILE SPST-NO 0.05A 50V, Body=7.4x7.4mm; Manufacturer: E-Switch; Manufacturer PN: TL6120DF300QG
U1 = STM32L433RCT6: as U1 on sheet Controller; Status: Symbol available; Manufacturer_Part_Number: STM32L433RCT6; Value: STM32L433RCT6
U2 = TI-BQ24074RGT16: PMIC 1.5A Li-Ion Battery Charger; Manufacturer: TI; Manufacturer PN: BQ24074RGT16
U3 = CMP-0395-00250-1: Single Output Low Noise LDO, 400 mA, Fixed 3.3 V Output, 1.7 to 5.5 V Input, with Reverse Current Protection, 5-pin SOT-23 (DBV), -40 to 85 degC,; Manufacturer: Texas Instruments; Vdo(Typ)(mV): 75; Vout Adj(Min)(V): 3.3; Rating: Catalog; Vin(Min)(V): 1.7; Iout(Max)(A): 0.4; Vin(Max)(V): 5.5; Iq(Typ)(mA): 0.3; SubFamily: Single Channel LDO; Eco-Plan: Green (RoHS & no Sb/Br); Accuracy(%): 1; ComponentLink2URL: http://www.ti.com/general/docs/lit/getliterature.tsp?genericPartNumber=TPS73633&fileType=pdf; ComponentLink1URL: http://www.ti.com/; ComponentLink2Description: Datasheet; DatasheetVersion: SBVS038T; Mounting Technology: Surface Mount; Fixed Output Options(V): 3.3; ComponentLink3Description: Package Specification; ComponentLink3URL: http://www.ti.com/litv/pdf/mpds018i; ComponentLink4Description: URL Link1; PackageReference: DBV5; ComponentLink4URL: Samples URL:http://www.ti.com/product/tps73633#samples; Vout Adj(Max)(V): 3.3; PackageVersion: 4073253-4/K; PackageDescription: 5-Pin Plastic Small Outline, Body 1.60 Ãƒâ€” 2.90 mm, Pitch 0.95 mm; ComponentLink1Description: Manufacturer URL; Code_JEDEC: MO-178; PartNumber: TPS73633DBVTG4

## Nets that join several sheets
BR_VDD: Controller (10 pins), MCU/ST1 (8 pins), MCU/ST2 (8 pins), MCU/ST3 (8 pins), MCU/ST4 (8 pins), Power (10 pins)
GND: Controller (18 pins), MCU/ST1 (12 pins), MCU/ST2 (12 pins), MCU/ST3 (12 pins), MCU/ST4 (12 pins), Power (44 pins)
ADC_CLK: Controller (TP3.1 U1.14), MCU/ST1 (U5_ST1.3), MCU/ST2 (U5_ST2.3), MCU/ST3 (U5_ST3.3), MCU/ST4 (U5_ST4.3)
BUTTON: Controller (U1.38), Power (C23.2 D4.1 R16.2 R17.2)
DRDY#1: Controller (U1.30), MCU/ST1 (TP11_ST1.1 U5_ST1.14)
DRDY#2: Controller (U1.21), MCU/ST2 (TP11_ST2.1 U5_ST2.14)
DRDY#3: Controller (U1.17), MCU/ST3 (TP11_ST3.1 U5_ST3.14)
DRDY#4: Controller (U1.11), MCU/ST4 (TP11_ST4.1 U5_ST4.14)
PWR_CTL_1: Controller (U1.42), Power (R11.2 U2.6)
PWR_CTL_2: Controller (U1.36), Power (R12.1 U2.5)
SPI1_MISO: Controller (TP5.1 U1.22), MCU/ST1 (U5_ST1.15), MCU/ST2 (U5_ST2.15), MCU/ST3 (U5_ST3.15), MCU/ST4 (U5_ST4.15)
SPI1_MOSI: Controller (TP6.1 U1.23), MCU/ST1 (U5_ST1.16), MCU/ST2 (U5_ST2.16), MCU/ST3 (U5_ST3.16), MCU/ST4 (U5_ST4.16)
SPI1_SCK: Controller (TP4.1 U1.15), MCU/ST1 (U5_ST1.1), MCU/ST2 (U5_ST2.1), MCU/ST3 (U5_ST3.1), MCU/ST4 (U5_ST4.1)
ST_CS#1: Controller (U1.29), MCU/ST1 (TP10_ST1.1 U5_ST1.2)
ST_CS#2: Controller (U1.20), MCU/ST2 (TP10_ST2.1 U5_ST2.2)
ST_CS#3: Controller (U1.16), MCU/ST3 (TP10_ST3.1 U5_ST3.2)
ST_CS#4: Controller (U1.10), MCU/ST4 (TP10_ST4.1 U5_ST4.2)
USB_N: Controller (U1.44), Power (D1.2 J3.2)
USB_P: Controller (U1.45), Power (D2.2 J3.3)
V_LATCH: Controller (U1.41), Power (D3.1)

## Assembly variants
Default 8 Channel: not fitted X3